# Altium schematic sheet 20 MEMORY_CONTROL.SchDoc
size 871 x 576 mm
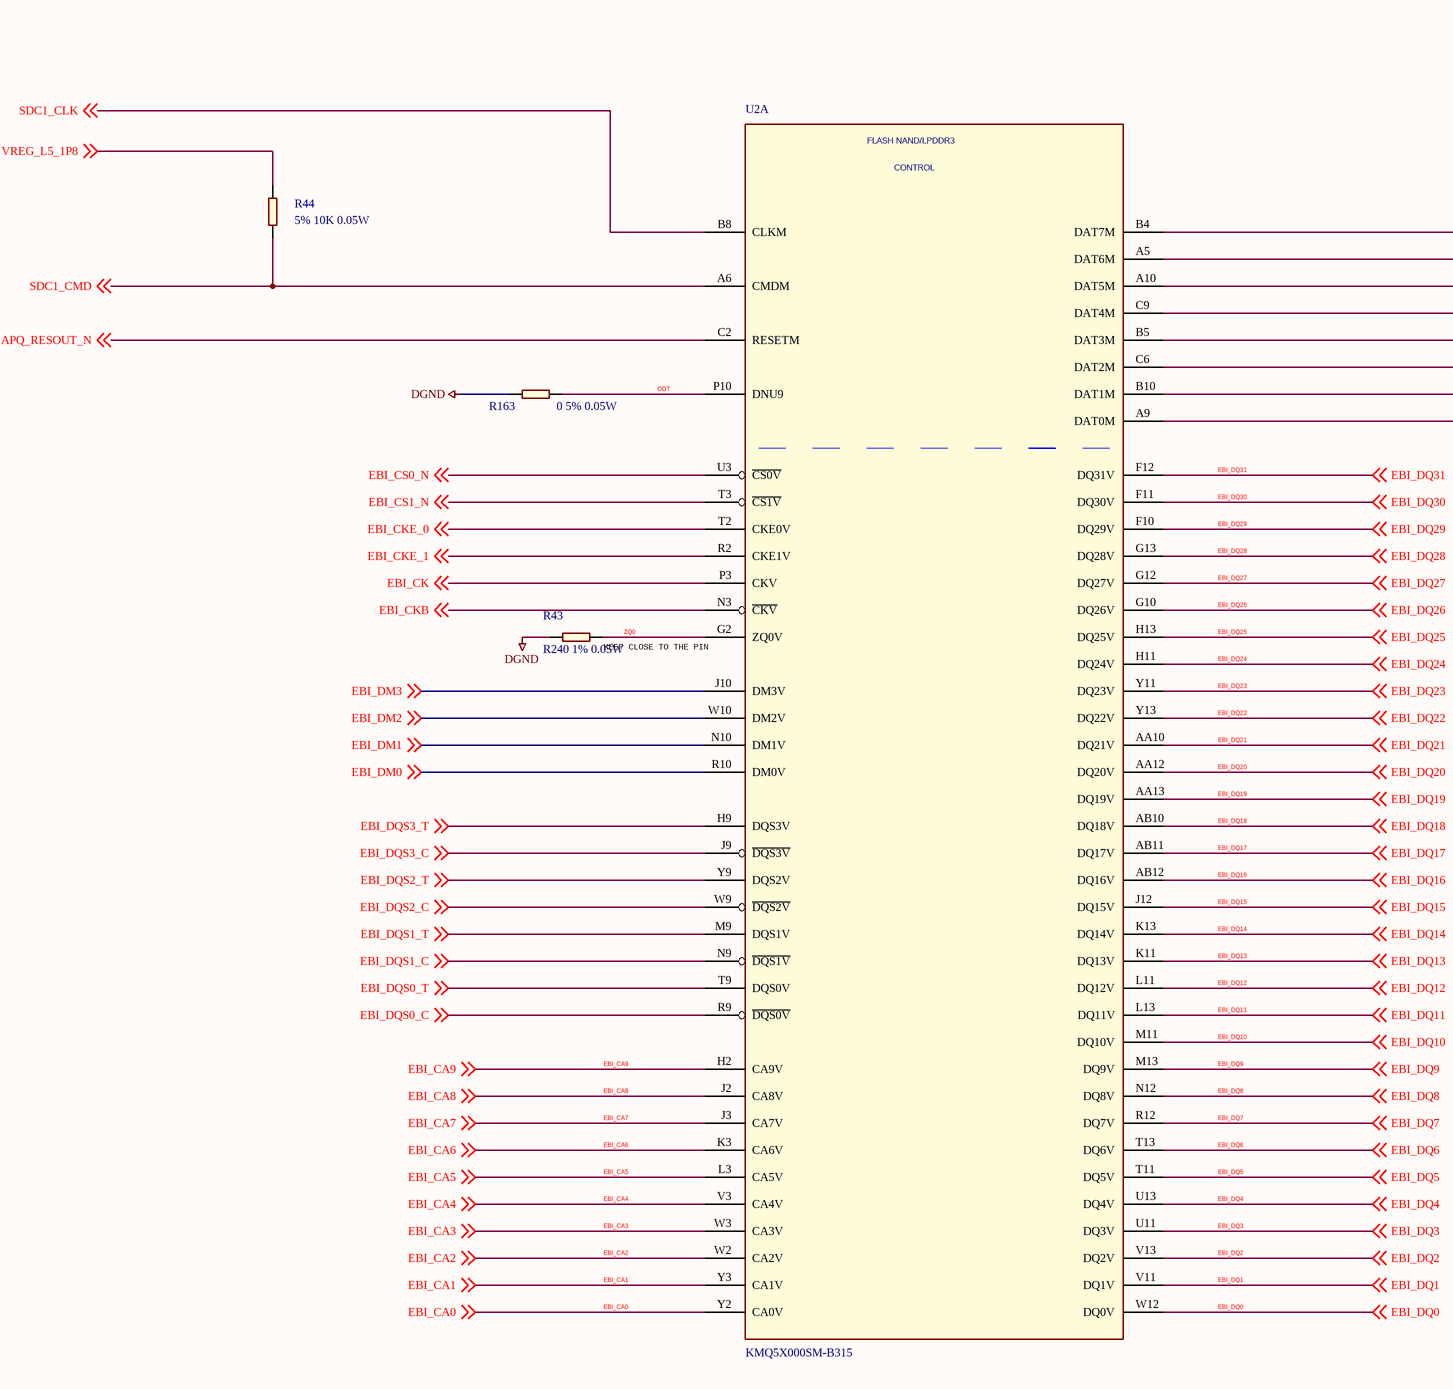
[diagram p0: 20 MEMORY_CONTROL.SchDoc, top left]
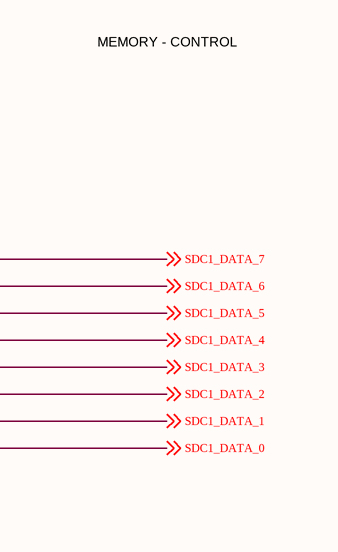
[diagram p1: 20 MEMORY_CONTROL.SchDoc, top middle]
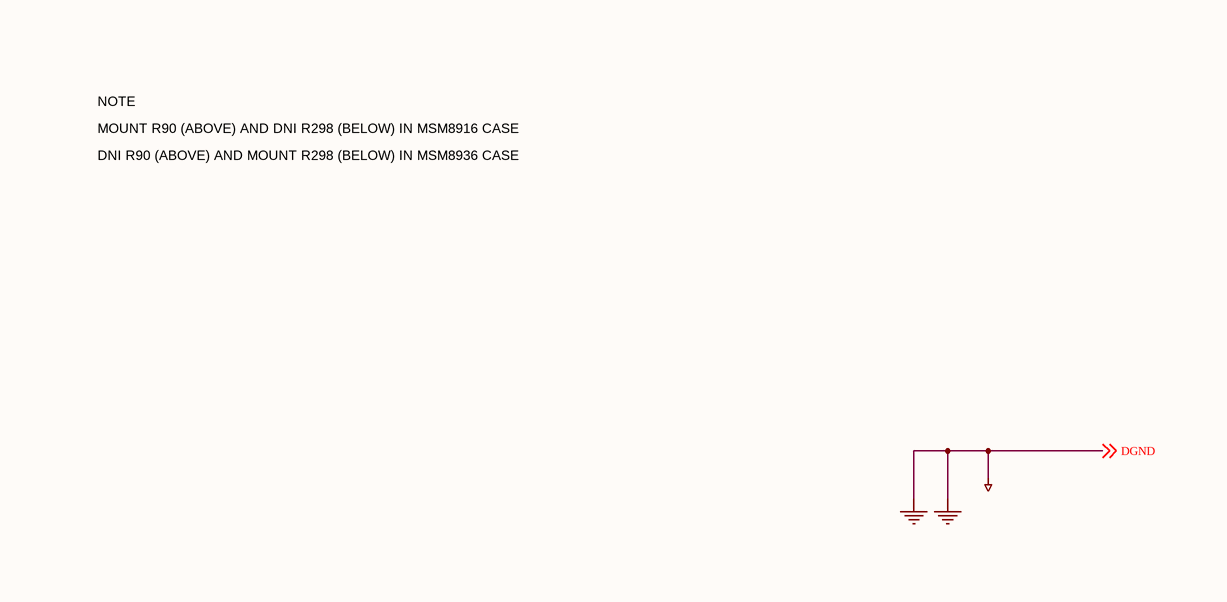
[diagram p2: 20 MEMORY_CONTROL.SchDoc, bottom left]
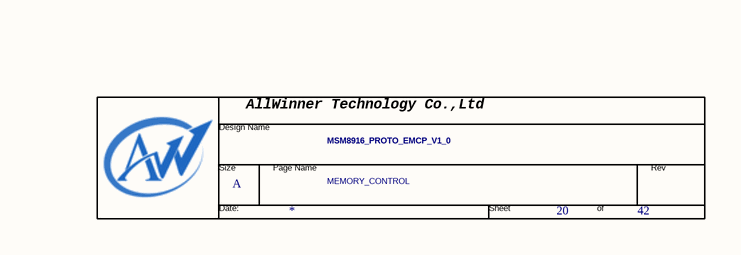
[diagram p3: 20 MEMORY_CONTROL.SchDoc, bottom right]

## Parts
*  Page Count: 42  Page Number: 20  Page Size: A  Title: MSM8916_PROTO_EMCP_V1_0  Doc: MEMORY_CONTROL  (hidden comment: TitleBlock0-AW)  (graphical)
R43  R240 1% 0.05W  [R0201]
R44  5% 10K 0.05W  [R0201]
R163  0 5% 0.05W  [R0201]
U2  KMQ5X000SM-B315  [KMQ5X000SM-B315]  (part A of 3)

## Nets
DGND: R43.1(PIN1) R163.1(PIN1) ; off-sheet DGND  [also labelled GND]
APQ_RESOUT_N: U2.C2(RESETM) ; off-sheet APQ_RESOUT_N
EBI_CA0: U2.Y2(CA0V) ; off-sheet EBI_CA0
EBI_CA1: U2.Y3(CA1V) ; off-sheet EBI_CA1
EBI_CA2: U2.W2(CA2V) ; off-sheet EBI_CA2
EBI_CA3: U2.W3(CA3V) ; off-sheet EBI_CA3
EBI_CA4: U2.V3(CA4V) ; off-sheet EBI_CA4
EBI_CA5: U2.L3(CA5V) ; off-sheet EBI_CA5
EBI_CA6: U2.K3(CA6V) ; off-sheet EBI_CA6
EBI_CA7: U2.J3(CA7V) ; off-sheet EBI_CA7
EBI_CA8: U2.J2(CA8V) ; off-sheet EBI_CA8
EBI_CA9: U2.H2(CA9V) ; off-sheet EBI_CA9
EBI_CK: U2.P3(CKV) ; off-sheet EBI_CK
EBI_CKB: U2.N3(~{CKV}) ; off-sheet EBI_CKB
EBI_CKE_0: U2.T2(CKE0V) ; off-sheet EBI_CKE_0
EBI_CKE_1: U2.R2(CKE1V) ; off-sheet EBI_CKE_1
EBI_CS0_N: U2.U3(~{CS0V}) ; off-sheet EBI_CS0_N
EBI_CS1_N: U2.T3(~{CS1V}) ; off-sheet EBI_CS1_N
EBI_DM0: U2.R10(DM0V) ; off-sheet EBI_DM0
EBI_DM1: U2.N10(DM1V) ; off-sheet EBI_DM1
EBI_DM2: U2.W10(DM2V) ; off-sheet EBI_DM2
EBI_DM3: U2.J10(DM3V) ; off-sheet EBI_DM3
EBI_DQ0: U2.W12(DQ0V) ; off-sheet EBI_DQ0
EBI_DQ1: U2.V11(DQ1V) ; off-sheet EBI_DQ1
EBI_DQ2: U2.V13(DQ2V) ; off-sheet EBI_DQ2
EBI_DQ3: U2.U11(DQ3V) ; off-sheet EBI_DQ3
EBI_DQ4: U2.U13(DQ4V) ; off-sheet EBI_DQ4
EBI_DQ5: U2.T11(DQ5V) ; off-sheet EBI_DQ5
EBI_DQ6: U2.T13(DQ6V) ; off-sheet EBI_DQ6
EBI_DQ7: U2.R12(DQ7V) ; off-sheet EBI_DQ7
EBI_DQ8: U2.N12(DQ8V) ; off-sheet EBI_DQ8
EBI_DQ9: U2.M13(DQ9V) ; off-sheet EBI_DQ9
EBI_DQ10: U2.M11(DQ10V) ; off-sheet EBI_DQ10
EBI_DQ11: U2.L13(DQ11V) ; off-sheet EBI_DQ11
EBI_DQ12: U2.L11(DQ12V) ; off-sheet EBI_DQ12
EBI_DQ13: U2.K11(DQ13V) ; off-sheet EBI_DQ13
EBI_DQ14: U2.K13(DQ14V) ; off-sheet EBI_DQ14
EBI_DQ15: U2.J12(DQ15V) ; off-sheet EBI_DQ15
EBI_DQ16: U2.AB12(DQ16V) ; off-sheet EBI_DQ16
EBI_DQ17: U2.AB11(DQ17V) ; off-sheet EBI_DQ17
EBI_DQ18: U2.AB10(DQ18V) ; off-sheet EBI_DQ18
EBI_DQ19: U2.AA13(DQ19V) ; off-sheet EBI_DQ19
EBI_DQ20: U2.AA12(DQ20V) ; off-sheet EBI_DQ20
EBI_DQ21: U2.AA10(DQ21V) ; off-sheet EBI_DQ21
EBI_DQ22: U2.Y13(DQ22V) ; off-sheet EBI_DQ22
EBI_DQ23: U2.Y11(DQ23V) ; off-sheet EBI_DQ23
EBI_DQ24: U2.H11(DQ24V) ; off-sheet EBI_DQ24
EBI_DQ25: U2.H13(DQ25V) ; off-sheet EBI_DQ25
EBI_DQ26: U2.G10(DQ26V) ; off-sheet EBI_DQ26
EBI_DQ27: U2.G12(DQ27V) ; off-sheet EBI_DQ27
EBI_DQ28: U2.G13(DQ28V) ; off-sheet EBI_DQ28
EBI_DQ29: U2.F10(DQ29V) ; off-sheet EBI_DQ29
EBI_DQ30: U2.F11(DQ30V) ; off-sheet EBI_DQ30
EBI_DQ31: U2.F12(DQ31V) ; off-sheet EBI_DQ31
EBI_DQS0_C: U2.R9(~{DQS0V}) ; off-sheet EBI_DQS0_C
EBI_DQS0_T: U2.T9(DQS0V) ; off-sheet EBI_DQS0_T
EBI_DQS1_C: U2.N9(~{DQS1V}) ; off-sheet EBI_DQS1_C
EBI_DQS1_T: U2.M9(DQS1V) ; off-sheet EBI_DQS1_T
EBI_DQS2_C: U2.W9(~{DQS2V}) ; off-sheet EBI_DQS2_C
EBI_DQS2_T: U2.Y9(DQS2V) ; off-sheet EBI_DQS2_T
EBI_DQS3_C: U2.J9(~{DQS3V}) ; off-sheet EBI_DQS3_C
EBI_DQS3_T: U2.H9(DQS3V) ; off-sheet EBI_DQS3_T
ODT: R163.2(PIN2) U2.P10(DNU9)
SDC1_CLK: U2.B8(CLKM) ; off-sheet SDC1_CLK
SDC1_CMD: R44.1(PIN1) U2.A6(CMDM) ; off-sheet SDC1_CMD
SDC1_DATA_0: U2.A9(DAT0M) ; off-sheet SDC1_DATA_0
SDC1_DATA_1: U2.B10(DAT1M) ; off-sheet SDC1_DATA_1
SDC1_DATA_2: U2.C6(DAT2M) ; off-sheet SDC1_DATA_2
SDC1_DATA_3: U2.B5(DAT3M) ; off-sheet SDC1_DATA_3
SDC1_DATA_4: U2.C9(DAT4M) ; off-sheet SDC1_DATA_4
SDC1_DATA_5: U2.A10(DAT5M) ; off-sheet SDC1_DATA_5
SDC1_DATA_6: U2.A5(DAT6M) ; off-sheet SDC1_DATA_6
SDC1_DATA_7: U2.B4(DAT7M) ; off-sheet SDC1_DATA_7
VREG_L5_1P8: R44.2(PIN2) ; off-sheet VREG_L5_1P8
ZQ0: R43.2(PIN2) U2.G2(ZQ0V)

## Notes on the sheet
- MEMORY - CONTROL
- (near R43) KEEP CLOSE TO THE PIN
- NOTE
- MOUNT R90 (ABOVE) AND DNI R298 (BELOW) IN MSM8916 CASE
- DNI R90 (ABOVE) AND MOUNT R298 (BELOW) IN MSM8936 CASE
- (in symbol KMQ5X000SM-B315, part A) FLASH NAND/LPDDR3; CONTROL
- (in symbol TitleBlock0-AW) AllWinner Technology Co.,Ltd; Design Name; Size; Page Name; Rev; Date:; Sheet; of

## Library data of the parts
R43 R44 R163 = R0201
* = TitleBlock0-AW: RevCode: ?; Page Create Date: March  8, 1995; Page Modify Date: *